# Altium schematic sheet CPU.SchDoc: CONTROLADORA AIRPOPCORN
size A3; DocumentNumber: 10.00.0025; SheetNumber: 5; SheetTotal: 16
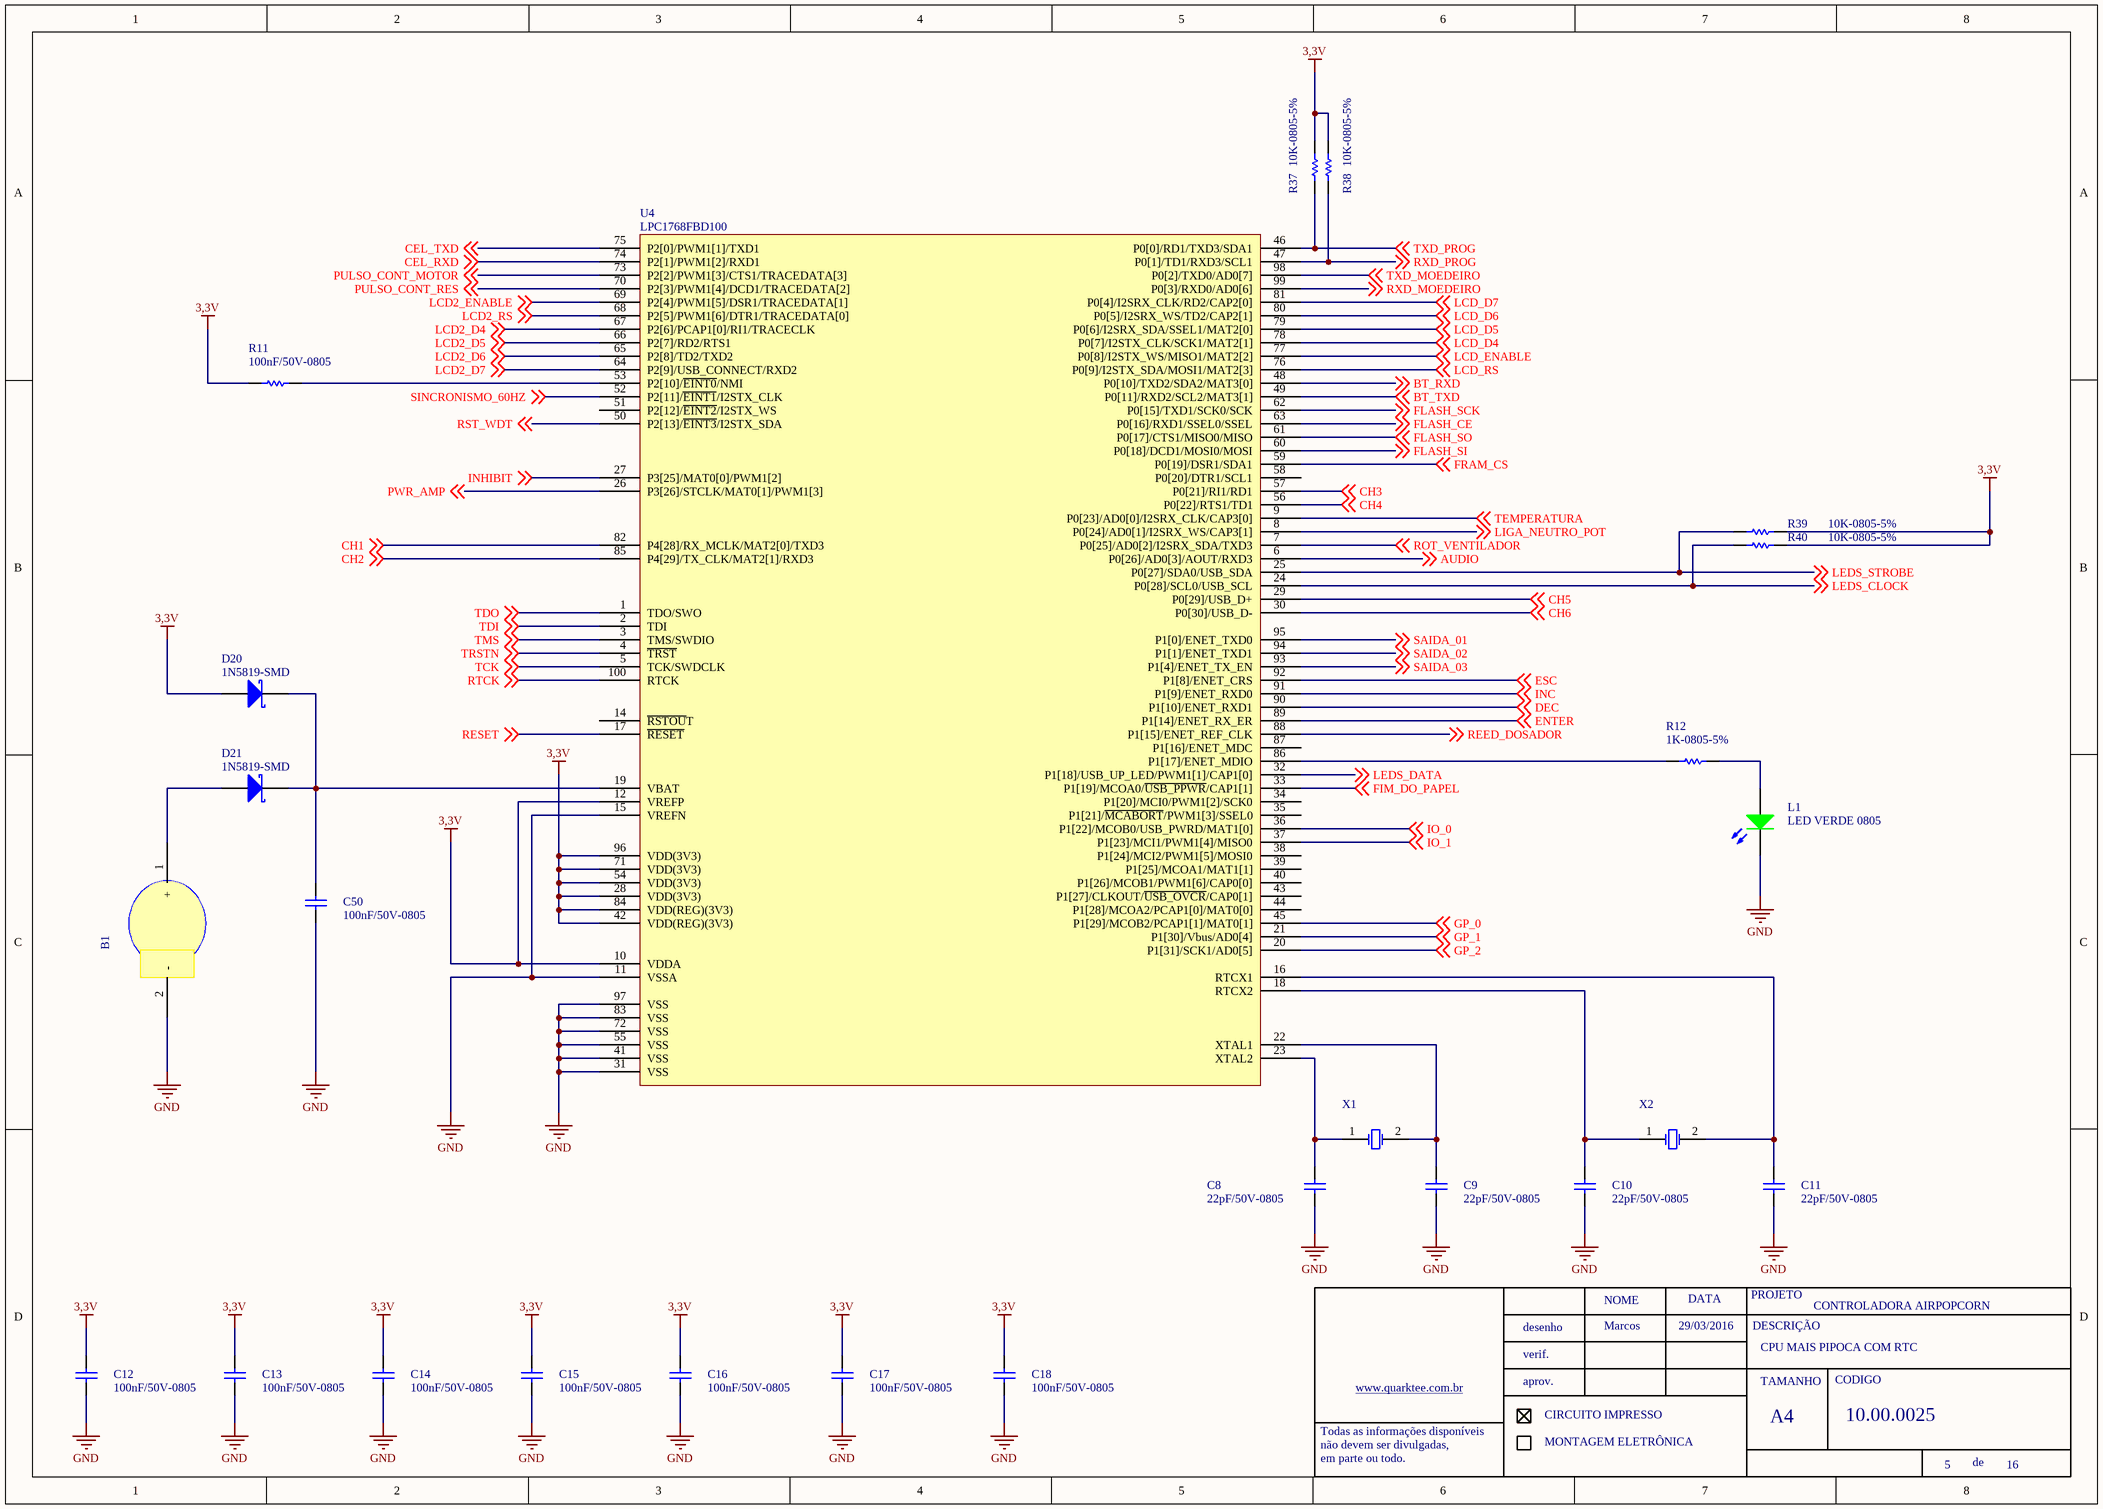
[diagram p0: CPU.SchDoc]

## Parts
B1  (no value)
C8  22pF/50V-0805  [0805-REVISADO O]
C9  22pF/50V-0805  [0805-REVISADO O]
C10  22pF/50V-0805  [0805-REVISADO O]
C11  22pF/50V-0805  [0805-REVISADO O]
C12  100nF/50V-0805  [0805-REVISADO O]
C13  100nF/50V-0805  [0805-REVISADO O]
C14  100nF/50V-0805  [0805-REVISADO O]
C15  100nF/50V-0805  [0805-REVISADO O]
C16  100nF/50V-0805  [0805-REVISADO O]
C17  100nF/50V-0805  [0805-REVISADO O]
C18  100nF/50V-0805  [0805-REVISADO O]
C50  100nF/50V-0805  [0805-REVISADO O]
D20  1N5819-SMD
D21  1N5819-SMD
L1  LED VERDE 0805  [LED 0805 - REVI]
R11  100nF/50V-0805  [0805-REVISADO O]
R12  1K-0805-5%  [0805-REVISADO O]
R37  10K-0805-5%  [0805-REVISADO O]
R38  10K-0805-5%  [0805-REVISADO O]
R39  10K-0805-5%  [0805-REVISADO O]
R40  10K-0805-5%  [0805-REVISADO O]
U4  LPC1768FBD100  [LQFP-100 pasta]
X1  (no value)  [XTALV']
X2  (no value)  [XTAL_32768']

## Nets
3,3V: C12.2 C13.2 C14.2 C15.2 C16.2 C17.2 C18.2 D20.1(A) R11.1 R37.2 R38.2 R39.2 R40.2 U4.10(VDDA) U4.12(VREFP) U4.28(VDD(3V3)) U4.42(VDD(REG)(3V3)) U4.54(VDD(3V3)) U4.71(VDD(3V3)) U4.84(VDD(REG)(3V3)) U4.96(VDD(3V3))
GND: B1.2(-) C8.1 C9.1 C10.1 C11.1 C12.1 C13.1 C14.1 C15.1 C16.1 C17.1 C18.1 C50.1 L1.2(K) U4.11(VSSA) U4.15(VREFN) U4.31(VSS) U4.41(VSS) U4.55(VSS) U4.72(VSS) U4.83(VSS) U4.97(VSS)
AUDIO: U4.6(P0[26]/AD0[3]/AOUT/RXD3) ; off-sheet AUDIO
BT_RXD: U4.48(P0[10]/TXD2/SDA2/MAT3[0]) ; off-sheet BT_RXD
BT_TXD: U4.49(P0[11]/RXD2/SCL2/MAT3[1]) ; off-sheet BT_TXD
CEL_RXD: U4.74(P2[1]/PWM1[2]/RXD1) ; off-sheet CEL_RXD
CEL_TXD: U4.75(P2[0]/PWM1[1]/TXD1) ; off-sheet CEL_TXD
CH1: U4.82(P4[28]/RX_MCLK/MAT2[0]/TXD3) ; off-sheet CH1
CH2: U4.85(P4[29]/TX_CLK/MAT2[1]/RXD3) ; off-sheet CH2
CH3: U4.57(P0[21]/RI1/RD1) ; off-sheet CH3
CH4: U4.56(P0[22]/RTS1/TD1) ; off-sheet CH4
CH5: U4.29(P0[29]/USB_D+) ; off-sheet CH5
CH6: U4.30(P0[30]/USB_D-) ; off-sheet CH6
DEC: U4.90(P1[10]/ENET_RXD1) ; off-sheet DEC
ENTER: U4.89(P1[14]/ENET_RX_ER) ; off-sheet ENTER
ESC: U4.92(P1[8]/ENET_CRS) ; off-sheet ESC
FIM_DO_PAPEL: U4.33(P1[19]/MCOA0/~{USB_PPWR}/CAP1[1]) ; off-sheet FIM_DO_PAPEL
FLASH_CE: U4.63(P0[16]/RXD1/SSEL0/SSEL) ; off-sheet FLASH_CE
FLASH_SCK: U4.62(P0[15]/TXD1/SCK0/SCK) ; off-sheet FLASH_SCK
FLASH_SI: U4.60(P0[18]/DCD1/MOSI0/MOSI) ; off-sheet FLASH_SI
FLASH_SO: U4.61(P0[17]/CTS1/MISO0/MISO) ; off-sheet FLASH_SO
FRAM_CS: U4.59(P0[19]/DSR1/SDA1) ; off-sheet FRAM_CS
GP_0: U4.45(P1[29]/MCOB2/PCAP1[1]/MAT0[1]) ; off-sheet GP_0
GP_1: U4.21(P1[30]/Vbus/AD0[4]) ; off-sheet GP_1
GP_2: U4.20(P1[31]/SCK1/AD0[5]) ; off-sheet GP_2
INC: U4.91(P1[9]/ENET_RXD0) ; off-sheet INC
INHIBIT: U4.27(P3[25]/MAT0[0]/PWM1[2]) ; off-sheet INHIBIT
IO_0: U4.36(P1[22]/MCOB0/USB_PWRD/MAT1[0]) ; off-sheet IO_0
IO_1: U4.37(P1[23]/MCI1/PWM1[4]/MISO0) ; off-sheet IO_1
LCD2_D4: U4.67(P2[6]/PCAP1[0]/RI1/TRACECLK) ; off-sheet LCD2_D4
LCD2_D5: U4.66(P2[7]/RD2/RTS1) ; off-sheet LCD2_D5
LCD2_D6: U4.65(P2[8]/TD2/TXD2) ; off-sheet LCD2_D6
LCD2_D7: U4.64(P2[9]/USB_CONNECT/RXD2) ; off-sheet LCD2_D7
LCD2_ENABLE: U4.69(P2[4]/PWM1[5]/DSR1/TRACEDATA[1]) ; off-sheet LCD2_ENABLE
LCD2_RS: U4.68(P2[5]/PWM1[6]/DTR1/TRACEDATA[0]) ; off-sheet LCD2_RS
LCD_D4: U4.78(P0[7]/I2STX_CLK/SCK1/MAT2[1]) ; off-sheet LCD_D4
LCD_D5: U4.79(P0[6]/I2SRX_SDA/SSEL1/MAT2[0]) ; off-sheet LCD_D5
LCD_D6: U4.80(P0[5]/I2SRX_WS/TD2/CAP2[1]) ; off-sheet LCD_D6
LCD_D7: U4.81(P0[4]/I2SRX_CLK/RD2/CAP2[0]) ; off-sheet LCD_D7
LCD_ENABLE: U4.77(P0[8]/I2STX_WS/MISO1/MAT2[2]) ; off-sheet LCD_ENABLE
LCD_RS: U4.76(P0[9]/I2STX_SDA/MOSI1/MAT2[3]) ; off-sheet LCD_RS
LEDS_CLOCK: R40.1 U4.24(P0[28]/SCL0/USB_SCL) ; off-sheet LEDS_CLOCK
LEDS_DATA: U4.32(P1[18]/USB_UP_LED/PWM1[1]/CAP1[0]) ; off-sheet LEDS_DATA
LEDS_STROBE: R39.1 U4.25(P0[27]/SDA0/USB_SDA) ; off-sheet LEDS_STROBE
LIGA_NEUTRO_POT: U4.8(P0[24]/AD0[1]/I2SRX_WS/CAP3[1]) ; off-sheet LIGA_NEUTRO_POT
PULSO_CONT_MOTOR: U4.73(P2[2]/PWM1[3]/CTS1/TRACEDATA[3]) ; off-sheet PULSO_CONT_MOTOR
PULSO_CONT_RES: U4.70(P2[3]/PWM1[4]/DCD1/TRACEDATA[2]) ; off-sheet PULSO_CONT_RES
PWR_AMP: U4.26(P3[26]/STCLK/MAT0[1]/PWM1[3]) ; off-sheet PWR_AMP
REED_DOSADOR: U4.88(P1[15]/ENET_REF_CLK) ; off-sheet REED_DOSADOR
RESET: U4.17(~{RESET}) ; off-sheet RESET
ROT_VENTILADOR: U4.7(P0[25]/AD0[2]/I2SRX_SDA/TXD3) ; off-sheet ROT_VENTILADOR
RST_WDT: U4.50(P2[13]/~{EINT3}/I2STX_SDA) ; off-sheet RST_WDT
RTCK: U4.100(RTCK) ; off-sheet RTCK
RXD_MOEDEIRO: U4.99(P0[3]/RXD0/AD0[6]) ; off-sheet RXD_MOEDEIRO
RXD_PROG: R38.1 U4.47(P0[1]/TD1/RXD3/SCL1) ; off-sheet RXD_PROG
SAIDA_01: U4.95(P1[0]/ENET_TXD0) ; off-sheet SAIDA_01
SAIDA_02: U4.94(P1[1]/ENET_TXD1) ; off-sheet SAIDA_02
SAIDA_03: U4.93(P1[4]/ENET_TX_EN) ; off-sheet SAIDA_03
SINCRONISMO_60HZ: U4.52(P2[11]/~{EINT1}/I2STX_CLK) ; off-sheet SINCRONISMO_60HZ
TCK: U4.5(TCK/SWDCLK) ; off-sheet TCK
TDI: U4.2(TDI) ; off-sheet TDI
TDO: U4.1(TDO/SWO) ; off-sheet TDO
TEMPERATURA: U4.9(P0[23]/AD0[0]/I2SRX_CLK/CAP3[0]) ; off-sheet TEMPERATURA
TMS: U4.3(TMS/SWDIO) ; off-sheet TMS
TRSTN: U4.4(~{TRST}) ; off-sheet TRSTN
TXD_MOEDEIRO: U4.98(P0[2]/TXD0/AD0[7]) ; off-sheet TXD_MOEDEIRO
TXD_PROG: R37.1 U4.46(P0[0]/RD1/TXD3/SDA1) ; off-sheet TXD_PROG
NetB1_1: B1.1(+) D21.1(A)
NetC8_2: C8.2 U4.23(XTAL2) X1.1(OSC1)
NetC9_2: C9.2 U4.22(XTAL1) X1.2(OSC2)
NetC10_2: C10.2 U4.18(RTCX2) X2.1(OSC1)
NetC11_2: C11.2 U4.16(RTCX1) X2.2(OSC2)
NetC50_2: C50.2 D20.2(K) D21.2(K) U4.19(VBAT)
NetL1_1: L1.1(A) R12.2
NetR11_2: R11.2 U4.53(P2[10]/~{EINT0}/NMI)
NetR12_1: R12.1 U4.86(P1[17]/ENET_MDIO)

Not connected (* = marked no-connect by the designer): U4 14(~{RSTOU}T) 34(P1[20]/MCI0/PWM1[2]/SCK0) 35(P1[21]/~{MCABORT}/PWM1[3]/SSEL0) 38(P1[24]/MCI2/PWM1[5]/MOSI0) 39(P1[25]/MCOA1/MAT1[1]) 40(P1[26]/MCOB1/PWM1[6]/CAP0[0]) 43(P1[27]/CLKOUT/~{USB_OVCR}/CAP0[1]) 44(P1[28]/MCOA2/PCAP1[0]/MAT0[0]) 51(P2[12]/~{EINT2}/I2STX_WS) 58(P0[20]/DTR1/SCL1) 87(P1[16]/ENET_MDC)

## Notes on the sheet
- Marcos
- 29/03/2016
- CPU MAIS PIPOCA COM RTC
- NOME
- DATA
- PROJETO
- DESCRIÇÃO
- www.quarktee.com.br
- desenho
- verif.
- aprov.
- TAMANHO
- CODIGO
- Todas as informações disponíveis
- não devem ser divulgadas,
- em parte ou todo.
- CIRCUITO IMPRESSO
- MONTAGEM ELETRÔNICA
- A4
- de

## Library data of the parts
B1 = SUPORTE PILHA CR2032: ERP: 437.00.100
C8-C11 = 22pF-0805-NPO: ERP: 104.11.001
C12-C18 C50 = 100nF/50-0805-NPO: ERP: 104.11.005
D20 D21 = 1N5819: ERP: 121.20.002
L1 = LED VERDE 0603 SMD: LED VERDE 0603 VERDE; ERP: 124.02.011
R11 = 10K-0805-5%: ERP: 102.11.054
U4 = LPC1768FDB100: ERP: 110.02.004
X1 = CRISTAL 12MHZ: 12MHZ; ERP: 134.01.003
X2 = CRISTAL 32.768 Hz: CRISTAL 32.768Hz; ERP: 134.01.002
R12 = 1K-0805-5%: ERP: 102.11.042
R37-R40 = 10K-0805-5%: ERP: 102.11.054